# EAGLE schematic ws2812_Triangle_V04 (EAGLE 7.7.0)
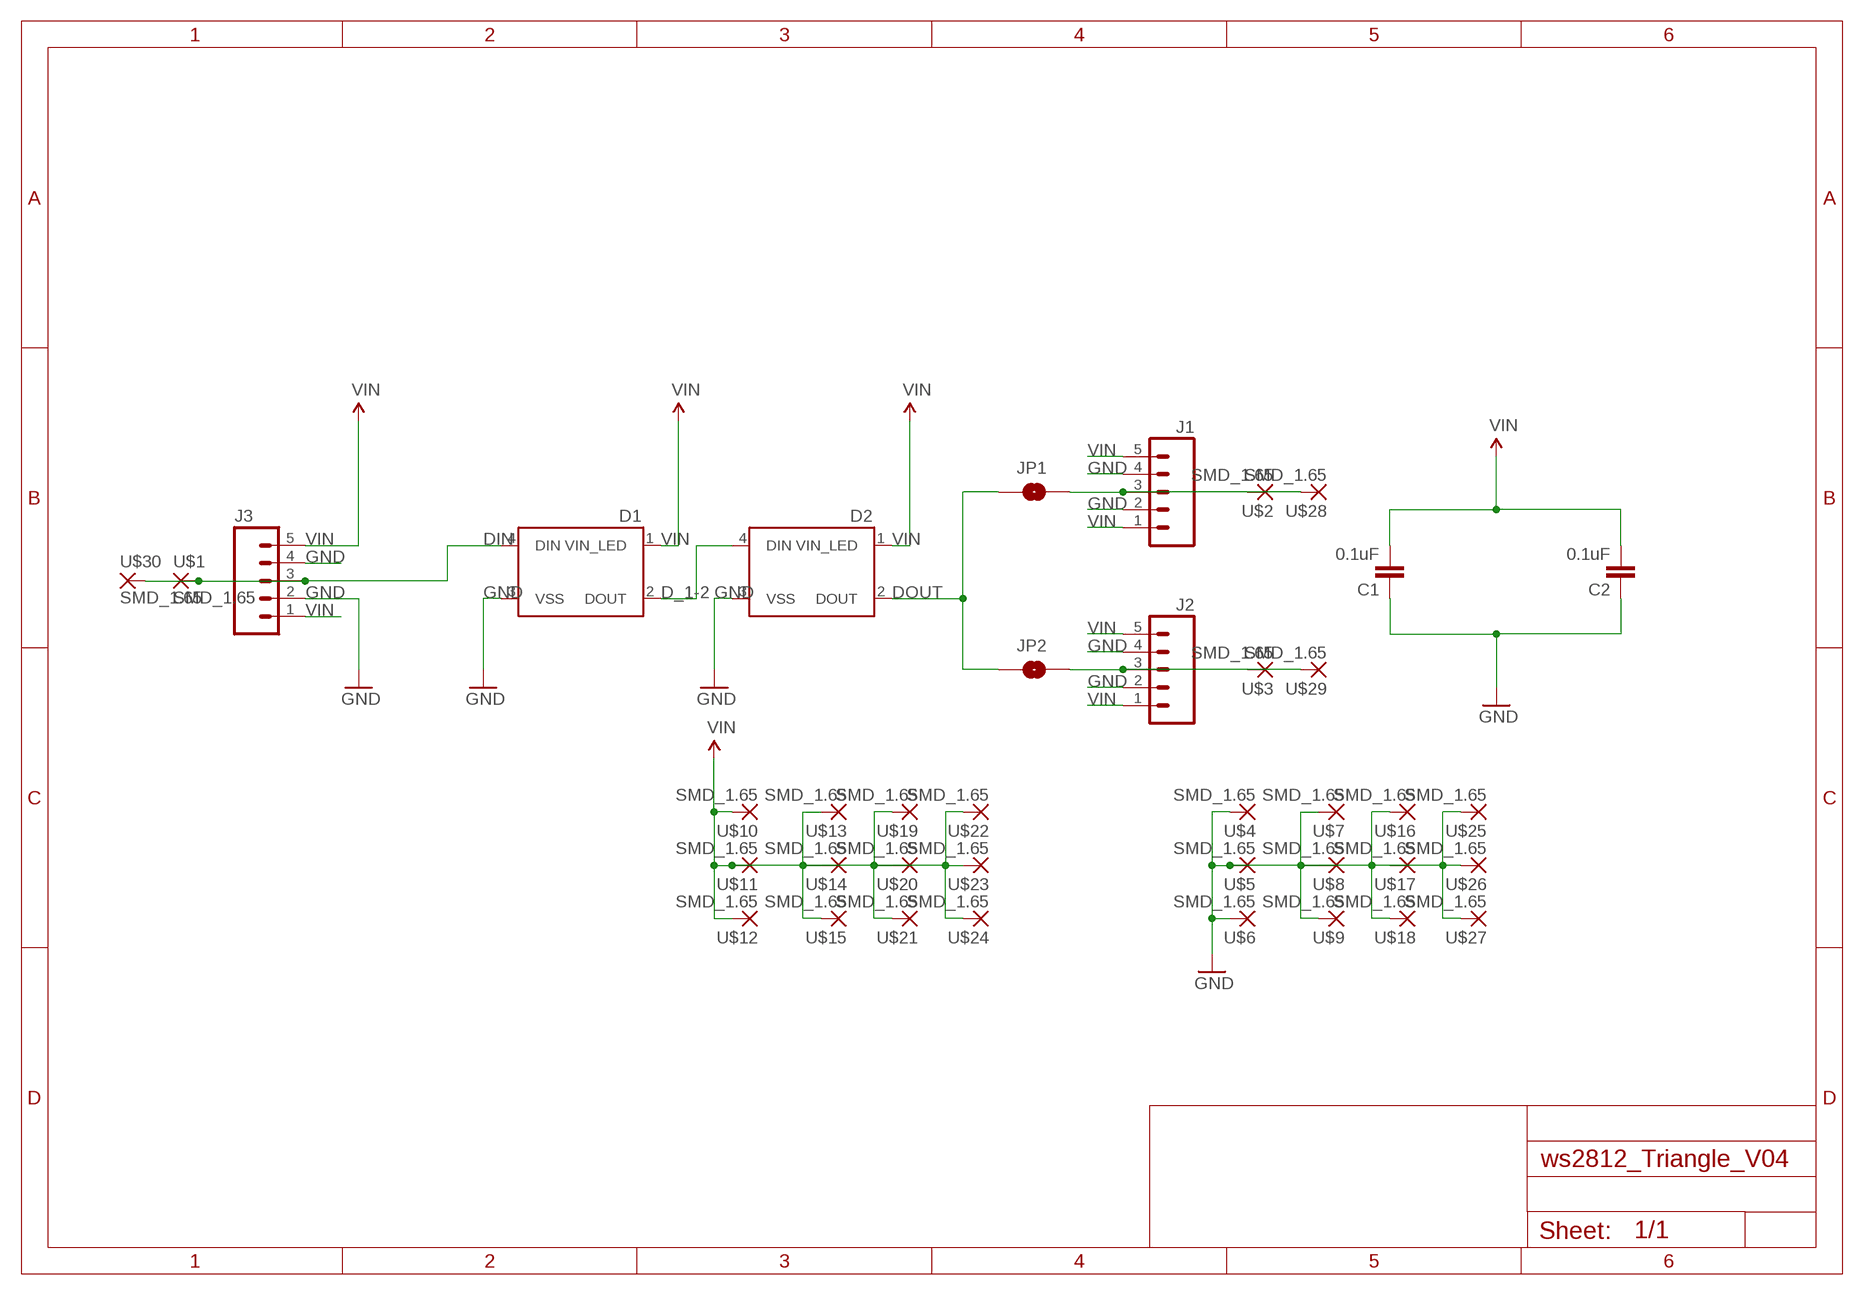
[diagram p0: schematic, sheet 1]

## Parts
C1  0.1uF  CAP0805  [0805]
C2  0.1uF  CAP0805  [0805]
D1  WS2812B  [WS2812B]
D2  WS2812B  [WS2812B]
J1  M05NO_SILK  [1X05_NO_SILK]
J2  M05NO_SILK  [1X05_NO_SILK]
J3  M05NO_SILK  [1X05_NO_SILK]
JP1  JUMPER-PAD-2-NOYES_SILK  [PAD-JUMPER-2-NO_YES_SILK]
JP2  JUMPER-PAD-2-NOYES_SILK  [PAD-JUMPER-2-NO_YES_SILK]
U$1  SMD_1.65  [SMD_PTH_1.65]
U$2  SMD_1.65  [SMD_PTH_1.65]
U$3  SMD_1.65  [SMD_PTH_1.65]
U$4  SMD_1.65  [SMD_PTH_1.65]
U$5  SMD_1.65  [SMD_PTH_1.65]
U$6  SMD_1.65  [SMD_PTH_1.65]
U$7  SMD_1.65  [SMD_PTH_1.65]
U$8  SMD_1.65  [SMD_PTH_1.65]
U$9  SMD_1.65  [SMD_PTH_1.65]
U$10  SMD_1.65  [SMD_PTH_1.65]
U$11  SMD_1.65  [SMD_PTH_1.65]
U$12  SMD_1.65  [SMD_PTH_1.65]
U$13  SMD_1.65  [SMD_PTH_1.65]
U$14  SMD_1.65  [SMD_PTH_1.65]
U$15  SMD_1.65  [SMD_PTH_1.65]
U$16  SMD_1.65  [SMD_PTH_1.65]
U$17  SMD_1.65  [SMD_PTH_1.65]
U$18  SMD_1.65  [SMD_PTH_1.65]
U$19  SMD_1.65  [SMD_PTH_1.65]
U$20  SMD_1.65  [SMD_PTH_1.65]
U$21  SMD_1.65  [SMD_PTH_1.65]
U$22  SMD_1.65  [SMD_PTH_1.65]
U$23  SMD_1.65  [SMD_PTH_1.65]
U$24  SMD_1.65  [SMD_PTH_1.65]
U$25  SMD_1.65  [SMD_PTH_1.65]
U$26  SMD_1.65  [SMD_PTH_1.65]
U$27  SMD_1.65  [SMD_PTH_1.65]
U$28  SMD_1.65  [SMD_PTH_1.65]
U$29  SMD_1.65  [SMD_PTH_1.65]
U$30  SMD_1.65  [SMD_PTH_1.65]

## Nets
D_1-2: D1.2(DOUT) D2.4(DIN)
DIN: D1.4(DIN) J3.3 U$1.P$1(P) U$30.P$1(P)
DOUT: D2.2(DOUT) JP1.1 JP2.1
GND: C1.1 C2.1 D1.3(VSS) D2.3(VSS) J1.2 J1.4 J2.2 J2.4 J3.2 J3.4 U$4.P$1(P) U$5.P$1(P) U$6.P$1(P) U$7.P$1(P) U$8.P$1(P) U$9.P$1(P) U$16.P$1(P) U$17.P$1(P) U$18.P$1(P) U$25.P$1(P) U$26.P$1(P) U$27.P$1(P)
N$1: J2.3 JP2.2 U$3.P$1(P) U$29.P$1(P)
N$2: J1.3 JP1.2 U$2.P$1(P) U$28.P$1(P)
VIN: C1.2 C2.2 D1.1(VIN_LED) D2.1(VIN_LED) J1.1 J1.5 J2.1 J2.5 J3.1 J3.5 U$10.P$1(P) U$11.P$1(P) U$12.P$1(P) U$13.P$1(P) U$14.P$1(P) U$15.P$1(P) U$19.P$1(P) U$20.P$1(P) U$21.P$1(P) U$22.P$1(P) U$23.P$1(P) U$24.P$1(P)

## Library data of the parts
C1 C2 = SparkFun-Capacitors:CAP: Capacitor Standard 0603 ceramic capacitor, and 0.1" leaded capacitor.
D1 D2 = SparkFun-LED:WS2812B: WS2812B - Intelligent control LED integrated light source Technical Specifications: Power Supply Voltage (VDD): 3.5 to 5.3 V Input Voltage (VI): -0.5 to VDD+0.5 V Operating Junction Temperature (Topt): -25°C to +80°C Storage Temperature Range (Tstg): -55°C to +150°C; PROD_ID: DIO-12503
J1-J3 = SparkFun-Connectors:M05: Header 5 Standard 5-pin 0.1" header. Use with straight break away headers (SKU : PRT-00116), right angle break away headers (PRT-00553), swiss pins (PRT-00743), machine pins (PRT-00117), and female headers (PRT-00115). Molex polarized connector foot print use with SKU : PRT-08230 with associated crimp pins and housings.
JP1 JP2 = SparkFun-Passives:JUMPER-PAD-2-NO
U$1-U$30 = Modified_wirepad:SMD_1.65